# EAGLE design Isolated_DMX_Module (EAGLE 9.6.2)
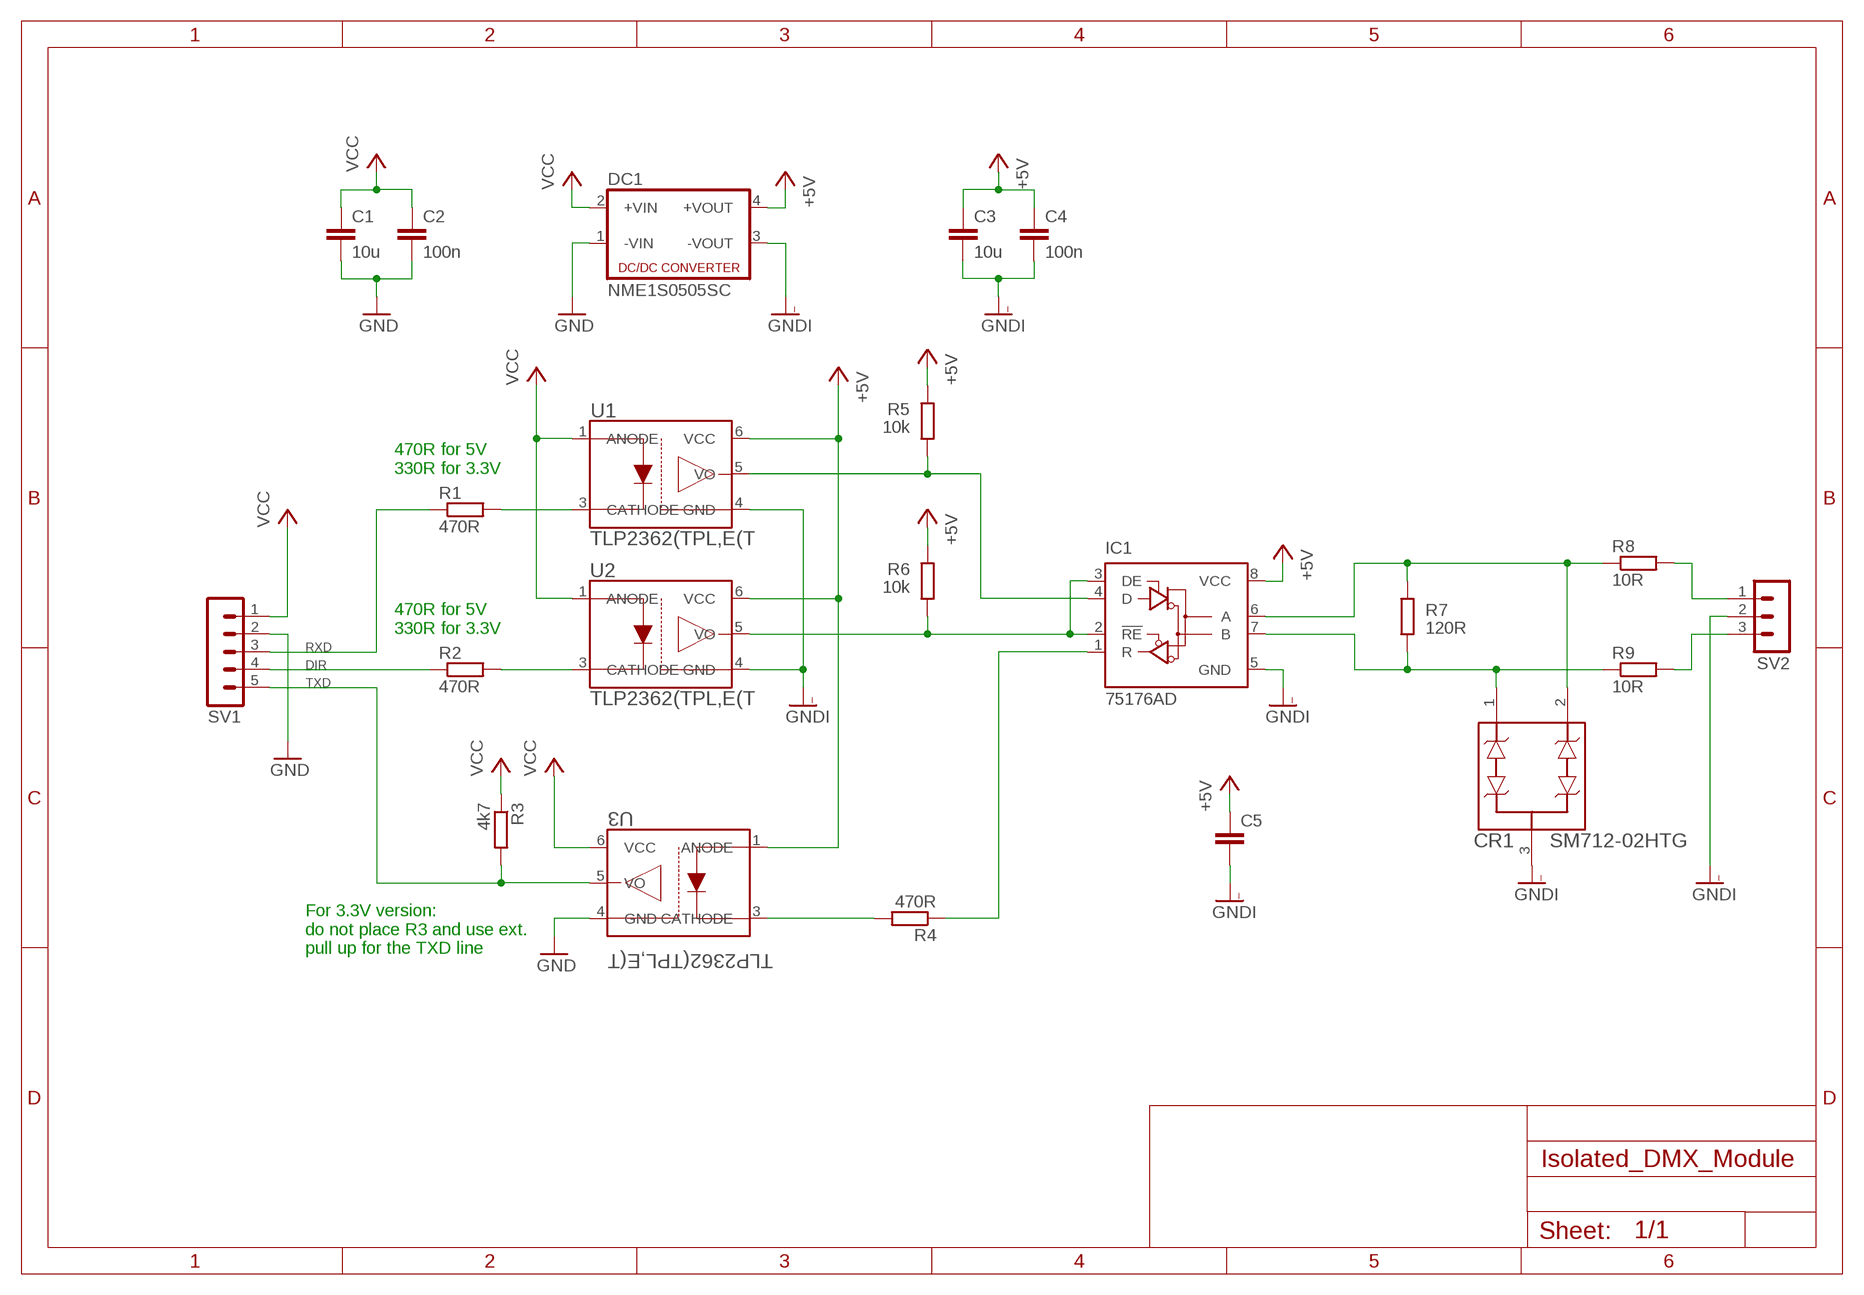
[diagram p0: schematic, sheet 1]

## Parts
C1  10u  C-EUC0805  [C0805]
C2  100n  C-EUC0603  [C0603]
C3  10u  C-EUC0805  [C0805]
C4  100n  C-EUC0603  [C0603]
C5  C-EUC0603  [C0603]
CR1  SM712-02HTG  [SOT23-3_LTF]
DC1  NME1S0505SC  NMEFLAT  [NME_FLAT]
IC1  75176AD  [D_R-PDSO-G8]
R1  470R  R-EU_R0603  [R0603]
R2  470R  R-EU_R0603  [R0603]
R3  4k7  R-EU_R0603  [R0603]
R4  470R  R-EU_R0603  [R0603]
R5  10k  R-EU_R0603  [R0603]
R6  10k  R-EU_R0603  [R0603]
R7  120R  R-EU_R0603  [R0603]
R8  10R  R-EU_R0603  [R0603]
R9  10R  R-EU_R0603  [R0603]
SV1  MA05-1  [MA05-1]
SV2  MA03-1  [MA03-1]
U1  TLP2362(TPL,E(T  [11-4L1S_TOS]
U2  TLP2362(TPL,E(T  [11-4L1S_TOS]
U3  TLP2362(TPL,E(T  [11-4L1S_TOS]

## Nets
+5V: C3.1 C4.1 C5.1 DC1.4(+VOUT) IC1.8(VCC) R5.1 R6.1 U1.6(VCC) U2.6(VCC) U3.1(ANODE)
DIR: R2.1 SV1.4
GND: C1.2 C2.2 DC1.1(-VIN) SV1.2 U3.4(GND)
GNDI: C3.2 C4.2 C5.2 CR1.3 DC1.3(-VOUT) IC1.5(GND) SV2.2 U1.4(GND) U2.4(GND)
N$1: IC1.1(R) R4.1
N$2: R4.2 U3.3(CATHODE)
N$3: IC1.2(!RE) IC1.3(DE) R6.2 U2.5(VO)
N$4: IC1.4(D) R5.2 U1.5(VO)
N$5: R1.2 U1.3(CATHODE)
N$6: R2.2 U2.3(CATHODE)
N$7: R8.2 SV2.1
N$8: R9.2 SV2.3
N$9: CR1.2 IC1.6(A) R7.1 R8.1
N$10: CR1.1 IC1.7(B) R7.2 R9.1
RXD: R1.1 SV1.3
TXD: R3.2 SV1.5 U3.5(VO)
VCC: C1.1 C2.1 DC1.2(+VIN) R3.1 SV1.1 U1.1(ANODE) U2.1(ANODE) U3.6(VCC)

## Notes on the sheet
- 470R for 5V
  330R for 3.3V
- 470R for 5V
  330R for 3.3V
- For 3.3V version:
  do not place R3 and use ext.
  pull up for the TXD line

## Library data of the parts
C1-C5 = rcl:C-EU: CAPACITOR, European symbol; SPICEPREFIX: C
CR1 = Eigene-Rietig:SM712-02HTG; COPYRIGHT: Copyright (C) 2024 Ultra Librarian. All rights reserved.; MANUFACTURER_PART_NUMBER: SM712-02HTG; MFR_NAME: Littelfuse Inc
DC1 = Eigene-Rietig:NME: DC-DC CONVERTER
IC1 = 751xx:75176A: DIFFERENTIAL BUS TRANSCEIVER Source: http://focus.ti.com/lit/ds/symlink/sn75176a.pdf
R1-R9 = rcl:R-EU_: RESISTOR, European symbol; SPICEPREFIX: R
SV1 = con-lstb:MA05-1: PIN HEADER; OC_FARNELL: unknown; OC_NEWARK: unknown
SV2 = con-lstb:MA03-1: PIN HEADER; OC_FARNELL: unknown; OC_NEWARK: unknown
U1-U3 = Eigene-Rietig:TLP2362(TPL,E(T; COPYRIGHT: Copyright (C) 2024 Ultra Librarian. All rights reserved.; MANUFACTURER_PART_NUMBER: TLP2362(TPL,E(T; MFR_NAME: Toshiba Electronic Devices & Storage Corp.

## Board
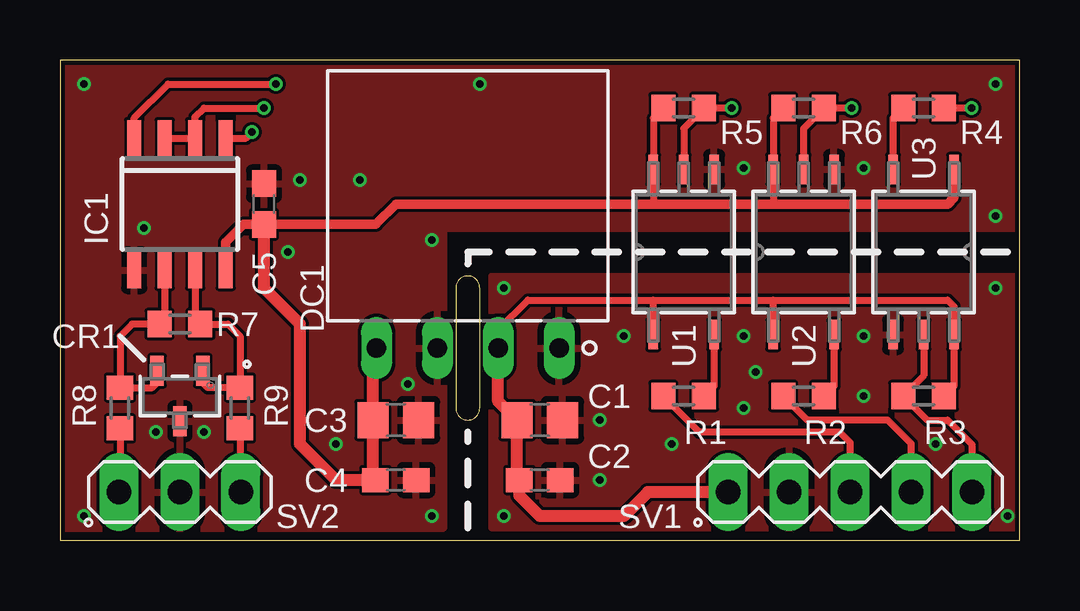
[diagram p1: board, top side]
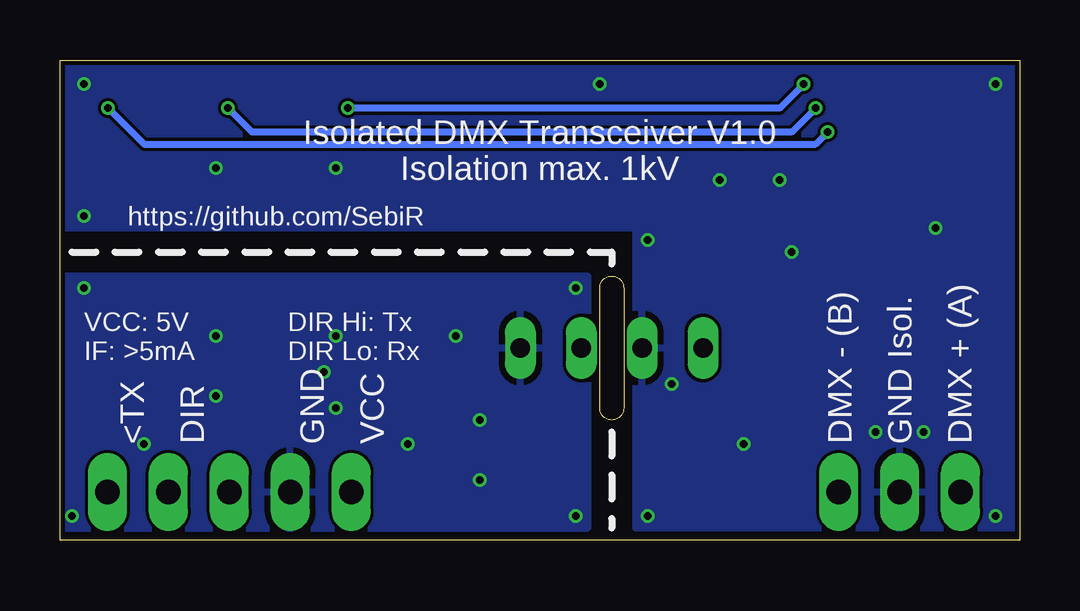
[diagram p2: board, bottom side, seen from below]

Size 40 x 20 mm. Coordinates in mm from the lower left corner, seen from the top.
Outline: 0,0 40,0 40,20 0,20 0,0
Outline: 16.5,10.5 16.5,5.5 arc90 17,5 arc90 17.5,5.5 17.5,10.5 arc90 17,11 arc90 16.5,10.5
Copper layers (1*16): Top 0.035mm / dielectric 1.6mm / Bottom 0.035mm
Design rules "jlcpcb-2layers": minimum track width 0.2mm, minimum drill 0.3mm, track to track 5mil, track to pad 5mil, pad to pad 5mil, via to via 5mil, smd to smd 5mil, copper to edge 0.2mm, drill to drill 6mil, minimum pad ring 0.125mm, minimum via ring 0.125mm, stop-mask expansion 4mil, vias tented up to drill 0.5mm, thermal gap 10mil

### Footprints (pad centres in the part's own frame; a part is rotated, then mirrored left to right if it is on the bottom)
C0805 = smd 1.3 x 1.5: 1 -0.95,0; 2 0.95,0
C0603 = smd 1.1 x 1: 1 -0.85,0; 2 0.85,0
SOT23-3_LTF = smd 0.559 x 1.245: 1 -0.95,-1.054; 2 0.95,-1.054; 3 0,1.054
NME_FLAT = drill 0.813 long: 1 0,3.81; 2 0,1.27; 3 0,-1.27; 4 0,-3.81
D_R-PDSO-G8 = smd 0.6 x 1.5: 1 -1.905,-2.75; 2 -0.635,-2.75; 3 0.635,-2.75; 4 1.905,-2.75; 5 1.905,2.75; 6 0.635,2.75; 7 -0.635,2.75; 8 -1.905,2.75
R0603 = smd 1 x 1.1: 1 -0.85,0; 2 0.85,0
MA05-1 = drill 1.016 long: 1 -5.08,0; 2 -2.54,0; 3 0,0; 4 2.54,0; 5 5.08,0
MA03-1 = drill 1.016 long: 1 -2.54,0; 2 0,0; 3 2.54,0
11-4L1S_TOS = smd 1.219 x 0.406: 1 -3.442,1.27; 3 -3.442,-1.27; 4 3.442,-1.27; 5 3.442,0; 6 3.442,1.27

### Placement (x,y rotation side)
C1  20,5 0 top
C2  20,2.5 0 top
C3  14,5 0 top
C4  14,2.5 0 top
C5  8.5,14 90 top
CR1  5,6 180 top
DC1  17,8 270 top
IC1  5,14 180 top
R1  26,6 0 top
R2  31,6 0 top
R3  36,6 180 top
R4  36,18 180 top
R5  26,18 0 top
R6  31,18 0 top
R7  5,9 0 top
R8  2.5,5.5 270 top
R9  7.5,5.5 270 top
SV1  32.94,2 0 top
SV2  5,2 0 top
U1  26,12 90 top
U2  31,12 90 top
U3  36,12 270 top

### Tracks (layer width: path | path; a pad name or v marks a point on that pad's centre or on a via)
+5V
  Top 0.3: 30,14 29.73,14 U2.6 29.73,17.58 R6.1 | 25,14 24.73,14 U1.6 24.73,17.58 R5.1
  Top 0.4: U3.1 37.27,14.27 37,14 30,14 25,14 14,14 13.19,13.19 13.15,13.15 C5.1 7.65,13.15 6.91,12.4 IC1.8 | C4.1 13.05,2.6
  Top 0.5: 13.05,2.6 C3.1 13.05,7.86 DC1.4 | C4.1 11.5,2.5 10,4 10,9 8.5,10.5 C5.1
DIR
  Top 0.3: R2.1 31.15,5 34.5,5 35.48,4.02 SV1.4
GND  (via drill 0.3)
  other vias: 39,10.5 39.5,1 18.5,1 18.5,10.5 33.5,8.5 23.5,8.5 28.5,8.5 28.5,5.5 33.5,6 36.5,4 25.5,4 29,7 22.5,5 22.5,2.5
  pour Top: 18,11 40,11 40,0.5 18,0.5
  pour Bottom: 18,11 40,11 40,0.5 18,0.5
GNDI  (via drill 0.3)
  other vias: 10,15 3.5,13 1,19 1,1 15.5,1 15.5,12.5 39,19 39,13.5 33.5,15.5 28.5,15.5 14.5,6.5 12.5,15 17.5,19 4,4.5 6,4.5 11.5,4 9.5,12
  pour Top: 40,13 40,20 0,20 0,0.5 16,0.5 16,13
  pour Bottom: 16,0.5 16,13 40,13 40,20 0,20 0,0.5
N$1  (via drill 0.3)
  Top 0.3: IC1.1 7.75,16.75 v8,17 | v38,18 R4.1
  Bottom 0.3: v8,17 8.5,16.5 36.5,16.5 v38,18
N$2
  Top 0.3: U3.3 34.73,17.58 R4.2
N$3  (via drill 0.3)
  Top 0.3: U2.5 31,17.15 R6.2 v33,18 | v8.5,18 6,18 5.63,17.64 IC1.2 IC1.3
  Bottom 0.3: v8.5,18 9.5,17 32,17 v33,18
N$4  (via drill 0.3)
  Top 0.3: U1.5 26,17.15 R5.2 v28,18 | v9,19 4.5,19 3.1,17.59 IC1.4
  Bottom 0.3: v9,19 10,18 v28,18
N$5
  Top 0.3: U1.3 27.27,6.42 R1.2
N$6
  Top 0.3: U2.3 32.27,6.42 R2.2
N$7
  Top 0.3: R8.2 2.5,2.04 SV2.1
N$8
  Top 0.3: R9.2 7.5,2.04 SV2.3
N$9
  Top 0.3: R7.1 4,9 | 4,9 3,9 2.5,8.5 R8.1 3.85,6.35 4.05,6.55 CR1.2 | IC1.6 4.37,9.37 4,9
N$10
  Top 0.3: IC1.7 5.63,9.21 R7.2 7,9 7.5,8.5 R9.1 6.15,6.35 5.95,6.55 CR1.1
RXD
  Top 0.3: R1.1 26.65,4.5 32.5,4.5 32.94,4.06 SV1.3
TXD
  Top 0.3: U3.5 36,6.85 R3.2 | 35.15,5.85 R3.2 | R3.2 36.15,5 37,5 38.02,3.98 SV1.5
VCC
  Top 0.3: 24.73,10 29.73,10 | 29.73,10 37,10 37.27,9.73 U3.6 37.27,6.42 R3.1 | U1.1 24.73,10 | U2.1 29.73,10 | 18.27,8.77 19.5,10 24.73,10
  Top 0.4: C2.1 19.05,2.6 | DC1.2 18.27,8.77
  Top 0.5: SV1.1 24.5,2 23.5,1 20,1 19.15,1.85 C2.1 | 19.05,2.6 C1.1 18.27,5.78 DC1.2

### Text on the board
bPlace: Isolated DMX Transceiver V1.0 | Isolation max. 1kV | https://github.com/SebiR | DIR Hi: Tx / DIR Lo: Rx | VCC: 5V / IF: >5mA | DMX + (A) | GND Isol. | DMX - (B) | VCC | GND | DIR | <TX